# Altium project PCB_Project2.PrjPCB
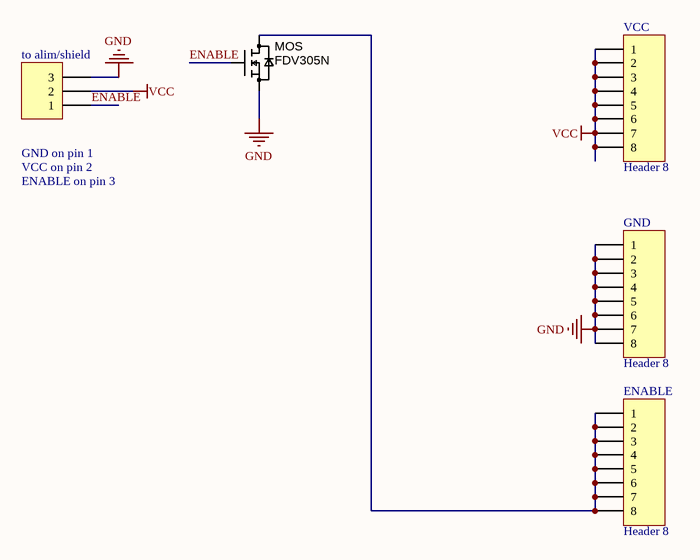
[diagram p0: Sheet2.SchDoc]
1 sheet, 5 parts. Net scope: global (net labels, ports and power ports of the same name join across sheets).
Board file: PCB3.PcbDoc

## Sheet Sheet2.SchDoc
size A4

### Parts
ENABLE  Header 8  [HDR1X8]
GND  Header 8  [HDR1X8]
MOS  FDV305N  [SOT23-3]
to_alim/shield  Header 3  [HDR1X3]  (value not drawn)
VCC  Header 8  [HDR1X8]

### Nets
GND: GND.1 GND.2 GND.3 GND.4 GND.5 GND.6 GND.7 GND.8 MOS.2(S) to_alim/shield.3
VCC: to_alim/shield.2 VCC.1 VCC.2 VCC.3 VCC.4 VCC.5 VCC.6 VCC.7 VCC.8
ENABLE: MOS.1(G) to_alim/shield.1
NetENABLE_1: ENABLE.1 ENABLE.2 ENABLE.3 ENABLE.4 ENABLE.5 ENABLE.6 ENABLE.7 ENABLE.8 MOS.3(D)

### Notes on the sheet
- (near to_alim/shield) GND on pin 1
- VCC on pin 2
- ENABLE on pin 3

### Library data of the parts
ENABLE GND VCC = Header 8: Header, 8-Pin; LatestRevisionDate: 17-Jul-2002; LatestRevisionNote: Re-released for DXP Platform.; Publisher: Altium Limited
MOS = T/FDV305N: MOSFET N SOT-23 20V 220mOhm; Supplier 1: Digi-Key; Supplier Part Number 1: FDV305NCT-ND
to_alim/shield = Header 3: Header, 3-Pin; LatestRevisionDate: 17-Jul-2002; LatestRevisionNote: Re-released for DXP Platform.; Publisher: Altium Limited